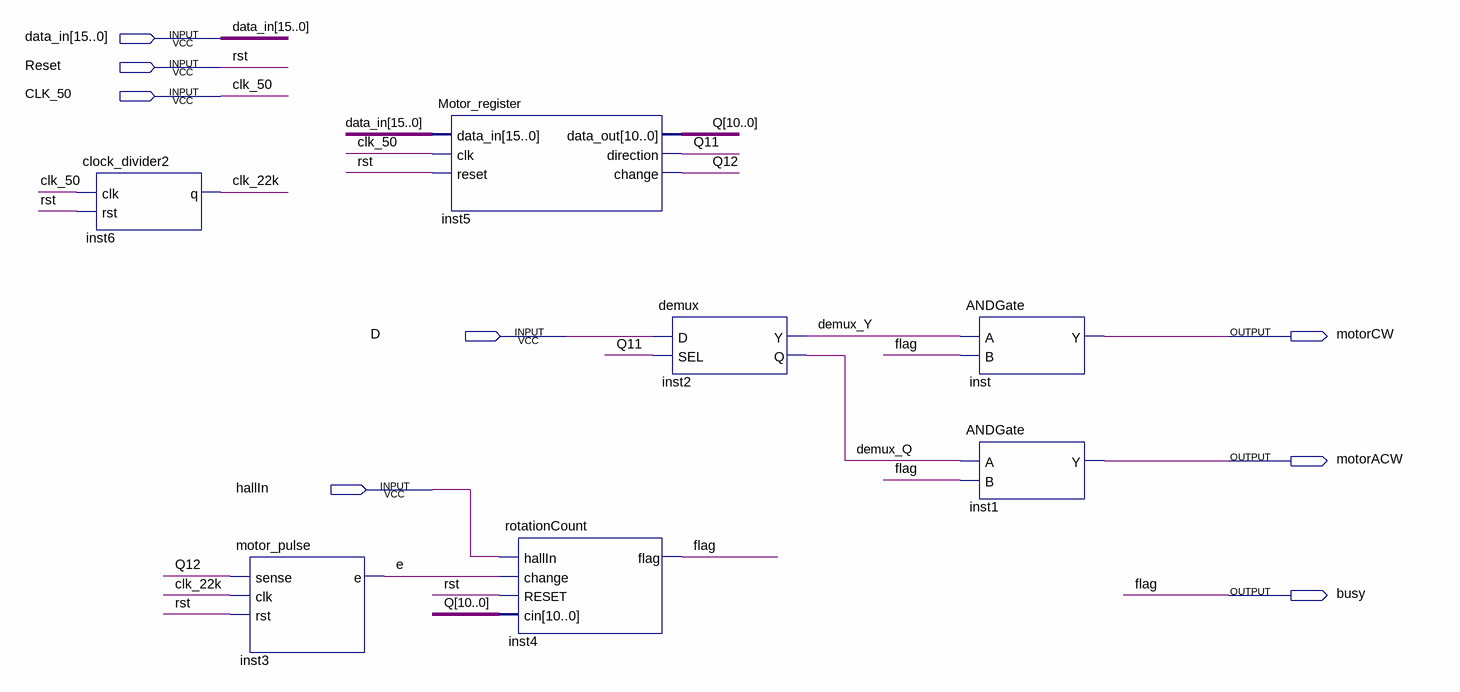
[diagram p0: schematic sheet]
// Quartus schematic motor_Logic.bdf as structural Verilog: 7 symbols, 8 pins
module motor_Logic (
  input  [15:0] data_in,
  input  Reset,
  input  CLK_50,
  input  D,
  input  hallIn,
  output motorCW,
  output motorACW,
  output busy
);

  wire clk_22k, demux_Q, demux_Y, e, Q11, Q12;
  wire [10:0] Q;

  clock_divider2 inst6 (.clk(CLK_50), .rst(Reset), .q(clk_22k));
  motor_pulse inst3 (.sense(Q12), .clk(clk_22k), .rst(Reset), .e(e));
  Motor_register inst5 (.data_in(data_in), .clk(CLK_50), .reset(Reset), .data_out(Q), .direction(Q11), .change(Q12));
  rotationCount inst4 (.hallIn(hallIn), .change(e), .RESET(Reset), .cin(Q), .flag(busy));
  demux inst2 (.D(D), .SEL(Q11), .Y(demux_Y), .Q(demux_Q));
  ANDGate inst (.A(demux_Y), .B(busy), .Y(motorCW));
  ANDGate inst1 (.A(demux_Q), .B(busy), .Y(motorACW));

  // Other names for the same wires on the sheet: flag = busy; rst = Reset
endmodule
